# EAGLE design SparkFun_Pulse_Oximeter_Heart-Rate_Sensor (EAGLE 9.6.2)
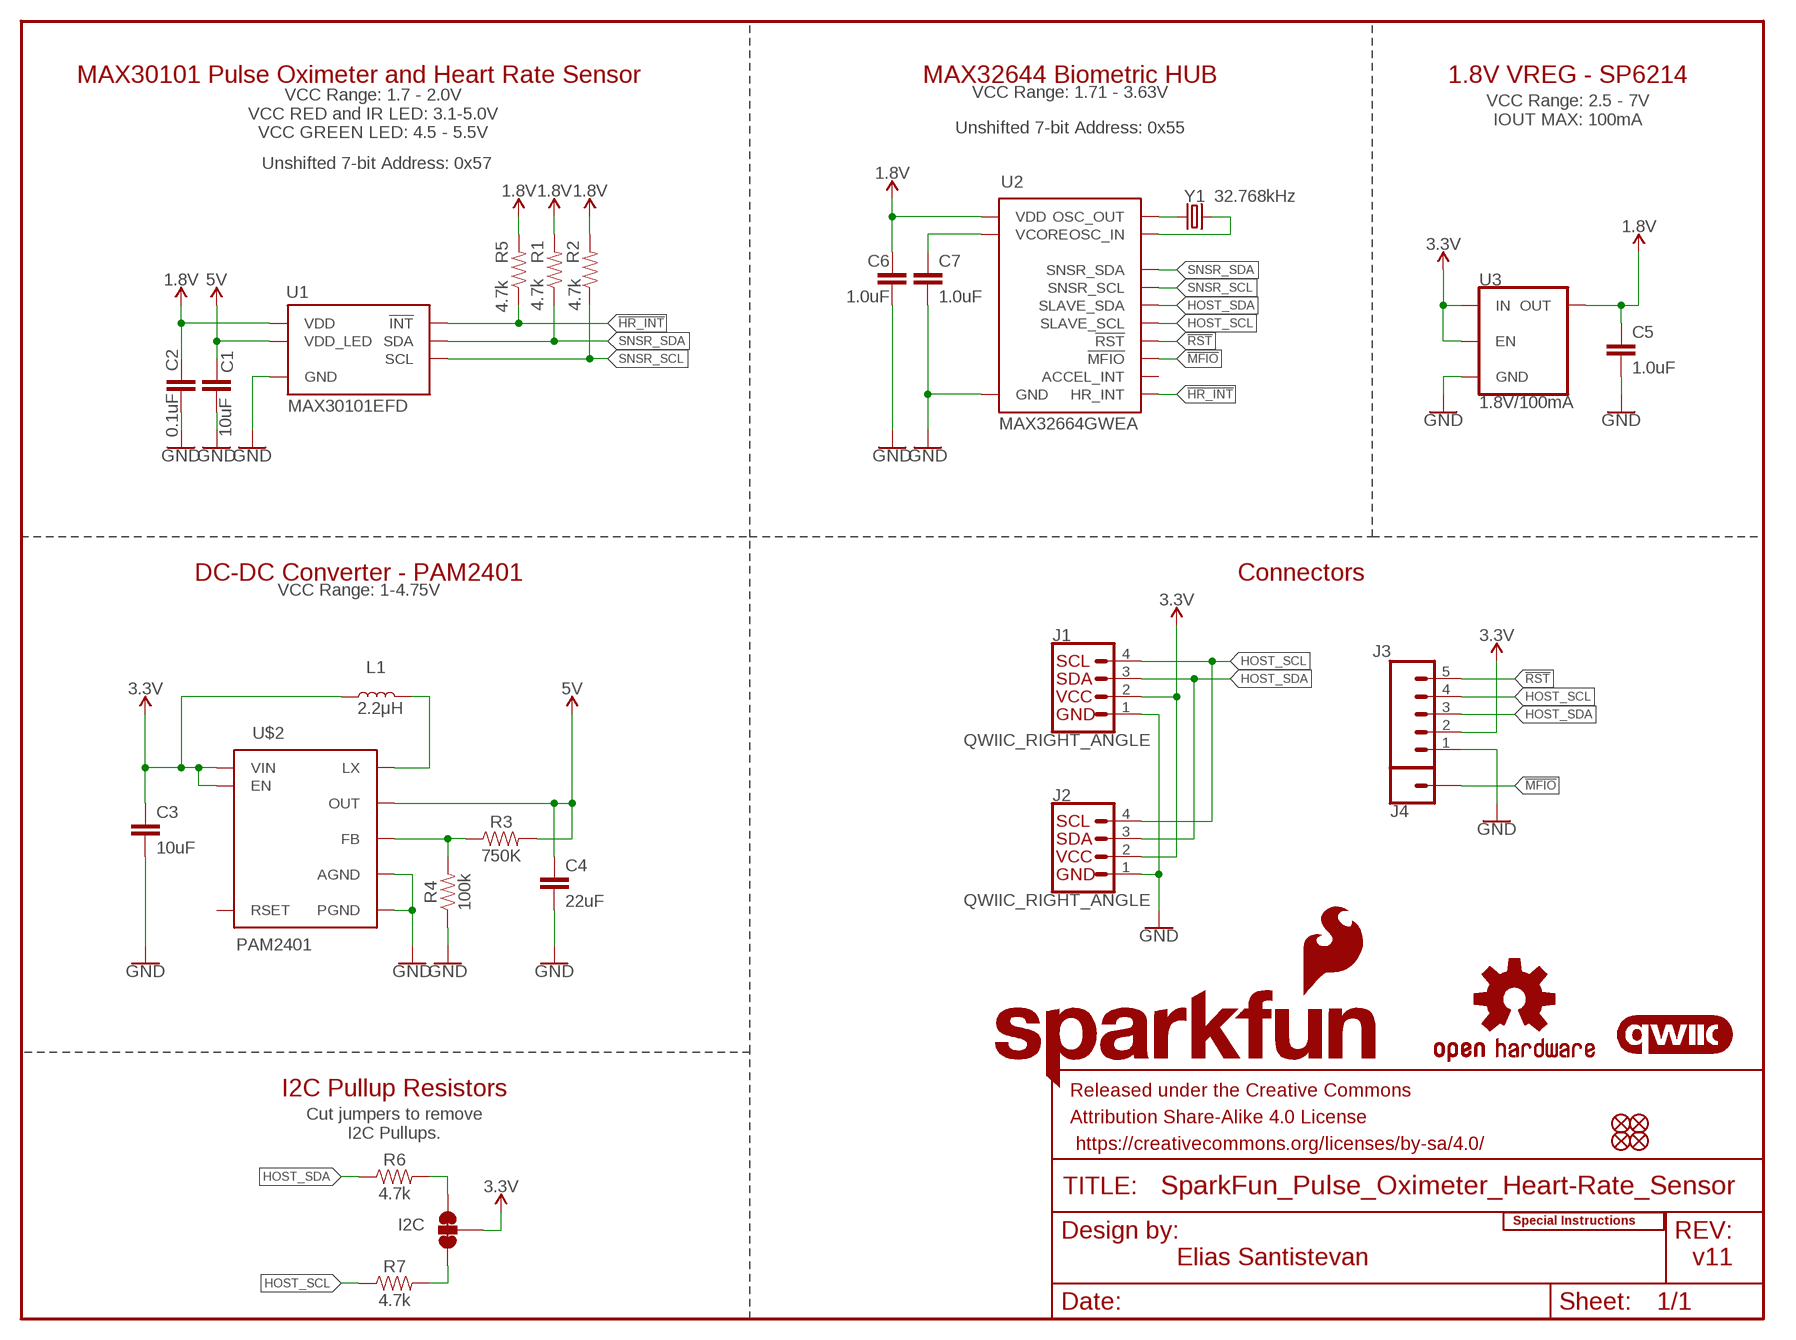
[diagram p0: schematic, sheet 1]

## Parts
C1  10uF  10UF-0603-6.3V-20%  [0603]
C2  0.1uF  0.1UF-0402T-16V-10%  [0402-TIGHT]
C3  10uF  10UF-0603-6.3V-20%  [0603]
C4  22uF  22UF-0805-6.3V-20%  [0805]
C5  1.0uF  1.0UF-0603-16V-10%  [0603]
C6  1.0uF  1.0UF-0402T-16V-10%  [0402-TIGHT]
C7  1.0uF  1.0UF-0402T-16V-10%  [0402-TIGHT]
FD1  FIDUCIALUFIDUCIAL  [FIDUCIAL-MICRO]
FD2  FIDUCIALUFIDUCIAL  [FIDUCIAL-MICRO]
FD3  FIDUCIALUFIDUCIAL  [FIDUCIAL-MICRO]
FD4  FIDUCIALUFIDUCIAL  [FIDUCIAL-MICRO]
FRAME1  FRAME-LETTER  [CREATIVE_COMMONS]
I2C  JUMPER-SMT_3_2-NC_TRACE_SILK  [SMT-JUMPER_3_2-NC_TRACE_SILK]
J1  QWIIC_RIGHT_ANGLE  QWIIC_CONNECTORJS-1MM  [JST04_1MM_RA]
J2  QWIIC_RIGHT_ANGLE  QWIIC_CONNECTORJS-1MM  [JST04_1MM_RA]
J3  CONN_05NO_SILK  [1X05_NO_SILK]
J4  CONN_01PTH_NO_SILK_YES_STOP  [1X01_NO_SILK]
L1  2.2μH  2.2μH_SHIELDED_INDUCTOR  [0806]
LOGO1  SFE_LOGO_FLAME.1_INCH  [SFE_LOGO_FLAME_.1]
LOGO2  OSHW-LOGOMINI  [OSHW-LOGO-MINI]
LOGO3  SFE_LOGO_NAME.1_INCH  [SFE_LOGO_NAME_.1]
LOGO4  SPECIAL_INSTRUCTIONS-ORDERING  [ORDERING_INSTRUCTIONS]
LOGO5  QWIIC_LOGO_4MM  [QWIIC_4MM]
R1  4.7k  4.7KOHM-0603-1/10W-1%  [0603]
R2  4.7k  4.7KOHM-0603-1/10W-1%  [0603]
R3  750K  750KOHM-0603-1/10W-1%  [0603]
R4  100k  100KOHM-0402T-1/16W-1%  [0402-TIGHT]
R5  4.7k  4.7KOHM-0603-1/10W-1%  [0603]
R6  4.7k  4.7KOHM-0603-1/10W-1%  [0603]
R7  4.7k  4.7KOHM-0603-1/10W-1%  [0603]
U1  MAX30101EFD  [14_PIN_OESIP]
U2  MAX32664GWEA  [16_PIN_WLP]
U3  1.8V/100mA  V_REG_SP6214-1.8V  [SC70]
U$2  PAM2401  [MSOP8]
Y1  32.768kHz  CRYSTAL-32.768KHZSMD-3.2X1.5  [CRYSTAL-SMD-3.2X1.5MM]

## Nets
1.8V: C2.1 C5.1 C6.1 R1.2 R2.2 R5.2 U1.P11(VDD) U2.3(VDD) U3.5(OUT)
3.3V: C3.1 I2C.2 J1.2 J2.2 J3.2 L1.1 U3.1(IN) U3.3(EN) U$2.2(EN) U$2.3(VIN)
5V: C1.1 C4.1 R3.2 U1.P9(VDD_LED) U1.P10(VDD_LED) U$2.7(OUT)
!HR_INT: R5.1 U1.P13(!INT) U2.6(HR_INT)
!MFIO: J4.1 U2.16(!MFIO)
!RST: J3.5 U2.12(!RST)
GND: C1.2 C2.2 C3.2 C4.2 C5.2 C6.2 C7.2 J1.1 J2.1 J3.1 R4.1 U1.P4(GND) U1.P12(GND) U2.13(GND) U3.2(GND) U$2.4(AGND) U$2.8(PGND)
HOST_SCL: J1.4 J2.4 J3.4 R7.1 U2.10(SLAVE_SCL)
HOST_SDA: J1.3 J2.3 J3.3 R6.1 U2.9(SLAVE_SDA)
N$1: C7.1 U2.4(VCORE)
N$2: R3.1 R4.2 U$2.5(FB)
N$3: L1.2 U$2.1(LX)
N$4: I2C.3 R6.2
N$5: I2C.1 R7.2
N$6: U2.1(OSC_OUT) Y1.P$1
N$7: U2.2(OSC_IN) Y1.P$2
SNSR_SCL: R2.1 U1.P2(SCL) U2.5(SNSR_SCL)
SNSR_SDA: R1.1 U1.P3(SDA) U2.14(SNSR_SDA)
Unconnected: U2.15(ACCEL_INT) U$2.6(RSET)

## Notes on the sheet
- MAX30101 Pulse Oximeter and Heart Rate Sensor | MAX32644 Biometric HUB | 1.8V VREG - SP6214
- VCC Range: 1.71 - 3.63V
- VCC Range: 2.5 - 7V
  IOUT MAX: 100mA
- VCC Range: 1.7 - 2.0V
  VCC RED and IR LED: 3.1-5.0V
  VCC GREEN LED: 4.5 - 5.5V
- Unshifted 7-bit Address: 0x55
- Unshifted 7-bit Address: 0x57
- DC-DC Converter - PAM2401 | Connectors
- VCC Range: 1-4.75V
- I2C Pullup Resistors
- Cut jumpers to remove
  I2C Pullups.
- Elias Santistevan | v11

## Library data of the parts
C1 C3 = SparkFun-Capacitors:10UF: 10.0µF ceramic capacitors A capacitor is a passive two-terminal electrical component used to store electrical energy temporarily in an electric field.; PROD_ID: CAP-11015
C2 = SparkFun-Capacitors:0.1UF: 0.1µF ceramic capacitors A capacitor is a passive two-terminal electrical component used to store electrical energy temporarily in an electric field.; PROD_ID: CAP-12416
C4 = SparkFun-Capacitors:22UF: 22µF ceramic capacitors A capacitor is a passive two-terminal electrical component used to store electrical energy temporarily in an electric field.; PROD_ID: CAP-08402
C5 = SparkFun-Capacitors:1.0UF: 1µF ceramic capacitors A capacitor is a passive two-terminal electrical component used to store electrical energy temporarily in an electric field.; PROD_ID: CAP-00868
C6 C7 = SparkFun-Capacitors:1.0UF: 1µF ceramic capacitors A capacitor is a passive two-terminal electrical component used to store electrical energy temporarily in an electric field.; PROD_ID: CAP-12417
FD1-FD4 = SparkFun-Aesthetics:FIDUCIAL: Fiducial Alignment Points Point-of-reference for pick-and-place machines and other optical instruments.
FRAME1 = SparkFun-Aesthetics:FRAME-LETTER: Schematic Frame - Letter Standard 8.5x11 US Letter frame
I2C = SparkFun-Jumpers:JUMPER-SMT_3_2-NC_TRACE: Normally closed trace jumper (2 of 2 connections) This jumper has a trace between all three pads so they are normally closed (NC). Use a razor knife to open the connection(s). For best results follow the IPC guidelines for cutting traces: Cutout at least 0.063 mm (0.005 in). Remove all loose material to clean up the cut area. Seal the cut with an approved epoxy. Reapply solder to reclose the connection(s).
J1 J2 = SparkFun-Connectors:QWIIC_CONNECTOR: SparkFun I2C Standard Qwiic Connector An SMD 1mm pitch JST connector makes it easy and quick (get it? Qwiic?) to connect I2C devices to each other. The Qwiic system <http://www.sparkfun.com/qwiic> enables fast and solderless connection between popular platforms and various sensors and actuators. We carry 200mm <https://www.sparkfun.com/products/14204>, 100mm <https://www.sparkfun.com/products/14205>, 50mm <https://www.sparkfun.com/products/14206>, and breadboard friendly <https://www.sparkfun.com/products/14207> Qwiic cables. We also offer 10 pcs strips <https://www.sparkfun.com/products/14323> the SMD connectors.; PROD_ID: CONN-13694
J3 = SparkFun-Connectors:CONN_05: Multi connection point. Often used as Generic Header-pin footprint for 0.1 inch spaced/style header connections On any of the 0.1 inch spaced packages, you can populate with these: Break Away Headers - Straight <https://www.sparkfun.com/products/116> (PRT-00116) Break Away Male Headers - Right Angle <https://www.sparkfun.com/products/553> (PRT-00553) Female Headers <https://www.sparkfun.com/products/115> (PRT-00115) Break Away Headers - Machine Pin <https://www.sparkfun.com/products/117> (PRT-00117) Break Away Female Headers - Swiss Machine Pin <https://www.sparkfun.com/products/743> (PRT-00743) For SCREWTERMINALS and SPRING TERMINALS visit here: Screw Terimnals on SparkFun.com <https://www.sparkfun.com/search/results?term=Screw+Terminals> (5mm/3.5mm/2.54mm spacing) This device is also useful as a general connection point to wire up your design to another part of your project. Our various solder wires solder well into these plated through hole pads. Hook-Up Wire - Assortment (Stranded, 22 AWG) <https://www.sparkfun.com/products/11375> (PRT-11375) Hook-Up Wire - Assortment (Solid Core, 22 AWG) <https://www.sparkfun.com/products/11367> (PRT-11367) View the entire wire category on our website here <https://www.sparkfun.com/categories/141> Special notes: Molex polarized connector foot print use with SKU : PRT-08231 with associated crimp pins and housings. 1MM SMD Version SKU: PRT-10208
J4 = SparkFun-Connectors:CONN_01: Single connection point. Often used as Generic Header-pin footprint for 0.1 inch spaced/style header connections On any of the 0.1 inch spaced packages, you can populate with these: Break Away Headers - Straight <https://www.sparkfun.com/products/116> (PRT-00116) Break Away Male Headers - Right Angle <https://www.sparkfun.com/products/553> (PRT-00553) Female Headers <https://www.sparkfun.com/products/115> (PRT-00115) Break Away Headers - Machine Pin <https://www.sparkfun.com/products/117> (PRT-00117) Break Away Female Headers - Swiss Machine Pin <https://www.sparkfun.com/products/743> (PRT-00743) This device is also useful as a general connection point to wire up your design to another part of your project. Our various solder wires solder well into these plated through hole pads. Hook-Up Wire - Assortment (Stranded, 22 AWG) <https://www.sparkfun.com/products/11375> (PRT-11375) Hook-Up Wire - Assortment (Solid Core, 22 AWG) <https://www.sparkfun.com/products/11367> (PRT-11367) View the entire wire category on our website here <https://www.sparkfun.com/categories/141> Special notes: SMTSO-256-ET is a "flush mount" nut for a 4-40 screw. We mostly use this on specialty testbeds; it is a nice way to connect hardware to your PCB at an adjustable hieght. Also note, the SNAP packages are for using a snappable style connector. We sell a baggie of snaps and they are also used on two LilyPad designs: Snap Assortment - 30 pack (male and female) <https://www.sparkfun.com/products/11347> (DEV-11347) LilyPad Arduino SimpleSnap <https://www.sparkfun.com/products/10941> (DEV-10941) LilyPad SimpleSnap Protoboard <https://www.sparkfun.com/products/10940> (DEV-10940)
L1 = SparkFun-Coils:2.2μH_SHIELDED_INDUCTOR: Murata 2.2uH Inductor 2.2uH 1.2A 110mOhm 0806 Package Shielded Bourns 2.2uH Inductor 2.2uH 5.5A 205mOhm 5x5mm Package Shielded; PROD_ID: NDUC-14257
LOGO1 = SparkFun-Aesthetics:SFE_LOGO_FLAME: SparkFun Flame Logo This is the SparkFun flame logo. The logo on the schematic will always be the same size; the package variant is the height of the flame. Default layer for the logo on the board is tSilk.
LOGO2 = SparkFun-Aesthetics:OSHW-LOGO: Open-Source Hardware (OSHW) Logo This logo indicates the piece of hardware it is found on incorporates a OSHW license and/or adheres to the definition of open source hardware found here: http://freedomdefined.org/OSHW
LOGO3 = SparkFun-Aesthetics:SFE_LOGO_NAME: SparkFun Font Logo This is the SparkFun name logo. The logo on the schematic will always be the same size; the package variant is the height of the flame part of the logo (or the height the flame would be, if it were drawn). Default layer for the logo on the board is tSilk.
LOGO4 = SparkFun-Aesthetics:SPECIAL_INSTRUCTIONS: Special Ordering/Production Instructions Alert Symbol for special PCB ordering instructions or unique production process warnings. Ordering Instructions Production Instructions Types of information that should be added to box: Copper weight Soldermask color Silk color PCB thickness Number of layers PCB Standard: 1.6mm FR4 1 oz copper immersion silver plating red soldermask white silkscreen Types of information that should be added to box: Special wash requirements Depaneling instructions Humidification Glue curing Default text settings: 0.07 inch 9% ratio 50% line distance
LOGO5 = SparkFun-Aesthetics:QWIIC_LOGO: Qwiic Logos for placement on schematic and PCB. The 5.5mm silk logo is best for placing next to Qwiic connector.
R1 R2 R5-R7 = SparkFun-Resistors:4.7KOHM: 4.7kΩ resistor A resistor is a passive two-terminal electrical component that implements electrical resistance as a circuit element. Resistors act to reduce current flow, and, at the same time, act to lower voltage levels within circuits. - Wikipedia; PROD_ID: RES-07857
R3 = SparkFun-Resistors:750KOHM: 750Ω resistor A resistor is a passive two-terminal electrical component that implements electrical resistance as a circuit element. Resistors act to reduce current flow, and, at the same time, act to lower voltage levels within circuits. - Wikipedia; PROD_ID: RES-13768
R4 = SparkFun-Resistors:100KOHM: 100kΩ resistor A resistor is a passive two-terminal electrical component that implements electrical resistance as a circuit element. Resistors act to reduce current flow, and, at the same time, act to lower voltage levels within circuits. - Wikipedia; PROD_ID: RES-13495
U1 = SparkFun-IC-Special-Function:MAX30101EFD: MAX30101 High-Sensitivity Pulse Oximeter and Heart-Rate Sensor The MAX30101 is an integrated pulse oximetry and heart-rate monitor module. It includes internal LEDs, photodetectors, optical elements, and low-noise electronics with ambient light rejection. The MAX30101 provides a complete system solution to ease the design-in process for mobile and wearable devices. The MAX30101 operates on a single 1.8V power supply and a separate 5.0V power supply for the internal LEDs. Communication is through a standard I2C-compatible interface. The module can be shut down through software with zero standby current, allowing the power rails to remain powered at all times; PROD_ID: IC-14270
U2 = SparkFun-IC-Special-Function:MAX32664GWEA: Maxim MAX32664 Biometric Sensor Hub he MAX32664 is a sensor hub family with embedded firmware and algorithms for wearables. It seamlessly enables customer-desired sensor functionality, including communication with Maxim’s optical sensor solutions and delivering raw or calculated data to the outside world. This is achieved while keeping overall system power consumption in check. The MAX32664 Version A supports the MAX30101/ MAX30102 high-sensitivity pulse oximeter and heart rate sensor for wearable health for finger-based applications.; PROD_ID: IC-14271
U3 = SparkFun-IC-Power:V_REG_SP6214: Voltage Regulator - SP6214 SP6214 Series SC-70-5 Micropower SC-70 100 mA CMOS LDO Regulator Datasheet <https://www.exar.com/content/document.ashx?id=654> SparkFun Products: MP3 Trigger <https://www.sparkfun.com/products/13720> SparkFun Particle Sensor Breakout <https://www.sparkfun.com/products/14045>; PROD_ID: VREG-08428
U$2 = SparkFun-IC-Power:PAM2401: PAM2401 - Boost PMIC Specifications: Up to 1A output current 0.9V to 4.75V Input Range 2.5V to 5.0V Adjustable Output Voltage Datasheet <https://www.diodes.com/assets/Datasheets/PAM2401.pdf> (Diodes inc.); PROD_ID: IC-13769
Y1 = SparkFun-Clocks:CRYSTAL-32.768KHZ: 32.768kHz Crystal Frequency: 32.768kHz Frequency Stability: ±20ppm Load Capacitance: 12.5pF (PTH-2X6 & SMD-3.2X1.5), 6pF (SMD-2X6) SparkFun Products: SparkFun BigTime Watch Kit <https://www.sparkfun.com/products/11734> SparkFun nRF52832 Breakout <https://www.sparkfun.com/products/13990> SparkFun Real Time Clock Module <https://www.sparkfun.com/products/12708>; PROD_ID: XTAL-13062

## Board
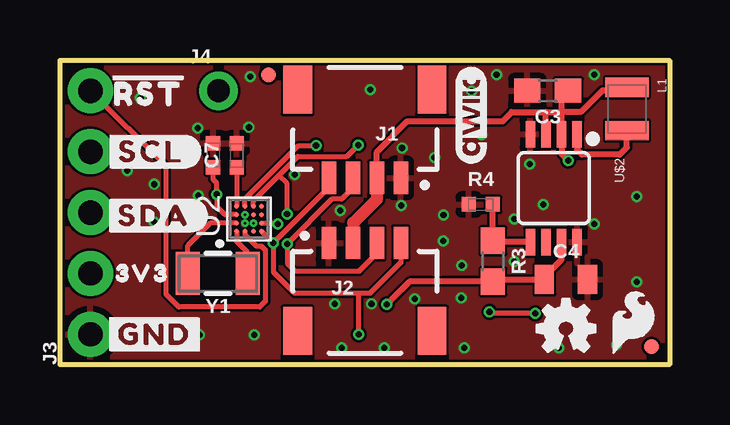
[diagram p1: board, top side]
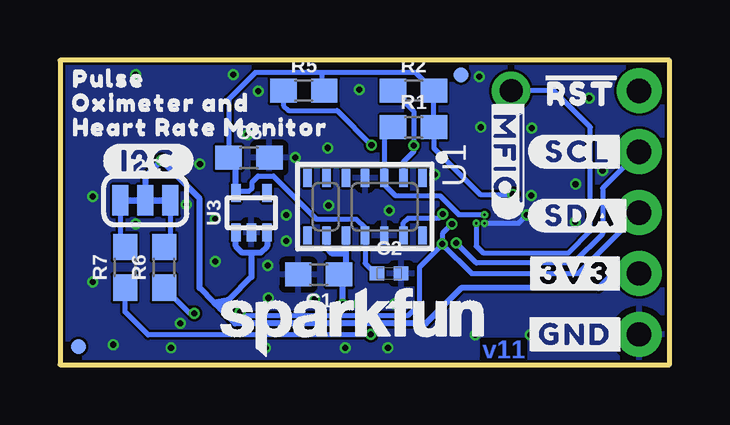
[diagram p2: board, bottom side, seen from below]

Size 25.4 x 12.7 mm. Coordinates in mm from the lower left corner, seen from the top.
Outline: 0,0 0,12.7 25.4,12.7 25.4,0 0,0
Copper layers (1*16): Top 0.035mm / dielectric 1.5mm / Bottom 0.035mm
Design rules "SparkFun-2-layer-FAB-LIMIT *": minimum track width 4mil, minimum drill 4mil, track to track 4mil, track to pad 4mil, pad to pad 4mil, via to via 4mil, smd to smd 4mil, copper to edge 4mil, drill to drill 4mil, minimum pad ring 5mil, minimum via ring 4mil, stop-mask expansion 4mil, vias tented up to drill 25mil, thermal gap 10mil

### Footprints (pad centres in the part's own frame; a part is rotated, then mirrored left to right if it is on the bottom)
0603 = smd 1.1 x 1: 1 -0.85,0; 2 0.85,0
0402-TIGHT = smd 0.6 x 0.6: 1 -0.5,0; 2 0.5,0
0805 = smd 0.8 x 1.2: 1 -0.9,0; 2 0.9,0
FIDUCIAL-MICRO = smd 0.635 x 0.635: 1 0,0
SMT-JUMPER_3_2-NC_TRACE_SILK = smd 0.66 x 1.27: 1 -1.041,0; 2 0,0; 3 1.041,0
JST04_1MM_RA = smd 0.6 x 1.35: 1 -1.5,0; 2 -0.5,0; 3 0.5,0; 4 1.5,0 | smd 1.2 x 2: NC1 2.8,-3.675; NC2 -2.8,-3.675
1X05_NO_SILK = drill 1.016 pad 1.88: 1 0,0; 2 2.54,0; 3 5.08,0; 4 7.62,0; 5 10.16,0
1X01_NO_SILK = drill 0.95 pad 1.6: 1 0,0
0806 = smd 0.8 x 1.8: 1 -0.9,0; 2 0.9,0
14_PIN_OESIP = smd 0.75 x 0.35: P1 -1.193,2.409; P2 -1.193,1.609; P3 -1.193,0.809; P4 -1.193,0.009; P5 -1.193,-0.791; P6 -1.193,-1.591; P7 -1.193,-2.391; P8 1.207,-2.391; P9 1.207,-1.591; P10 1.207,-0.791; P11 1.207,0.009; P12 1.207,0.809; P13 1.207,1.609; P14 1.207,2.409
16_PIN_WLP = smd 0.2 x 0.2: 1 -0.532,0.518; 2 -0.182,0.518; 3 0.168,0.518; 4 0.518,0.518; 5 0.518,0.168; 6 0.518,-0.182; 7 0.518,-0.532; 8 0.168,-0.532; 9 -0.182,-0.532; 10 -0.532,-0.532; 11 -0.532,-0.182; 12 -0.532,0.168; 13 -0.182,0.168; 14 0.168,0.168; 15 0.168,-0.182; 16 -0.182,-0.182
SC70 = smd 0.4 x 0.75: 1 -0.65,-0.825; 2 0,-0.825; 3 0.65,-0.825; 4 0.65,0.825; 5 -0.65,0.825
MSOP8 = smd 0.4 x 1.1: 1 -0.975,-2.25; 2 -0.325,-2.25; 3 0.325,-2.25; 4 0.975,-2.25; 5 0.975,2.25; 6 0.325,2.25; 7 -0.325,2.25; 8 -0.975,2.25
CRYSTAL-SMD-3.2X1.5MM = smd 1 x 1.8: P$1 -1.25,0; P$2 1.25,0

### Placement (x,y rotation side)
C1  14.62,3.76 180 bottom
C2  11.68,3.81 0 bottom
C3  20.32,11.43 180 top
C4  21.08,3.56 0 top
C5  17.53,8.64 0 bottom
C6  6.38,8.74 90 top
C7  7.37,8.74 90 top
FD1  8.69,12.08 0 bottom
FD2  8.69,12.08 0 top
FD3  24.64,0.76 0 bottom
FD4  24.64,0.76 0 top
FRAME1  -4.32,-10.16 0 top  (outside the outline)
I2C  21.84,6.86 0 bottom
J1  12.7,7.8 180 top
J2  12.7,5.08 0 top
J3  1.27,1.27 90 top
J4  6.6,11.43 0 top
L1  23.62,10.67 270 top
LOGO1  23.88,1.78 0 top
LOGO2  21.08,1.52 0 top
LOGO3  13.21,1.78 0 bottom
LOGO4  38.61,50.8 0 top  (outside the outline)
LOGO5  17.14,10.41 90 top
R1  10.67,9.91 0 bottom
R2  10.67,11.43 0 bottom
R3  18.03,4.32 270 top
R4  17.53,6.69 0 top
R5  15.24,11.43 0 bottom
R6  21.06,4.06 90 bottom
R7  22.68,4.06 90 bottom
U1  12.7,6.6 270 bottom
U2  7.87,6.1 90 top
U3  17.42,6.35 0 bottom
U$1  [#I2C#1348]  21.72,8.51 0 bottom
U$2  20.57,7.37 180 top
U$3  [#GND#0]  3.94,1.27 0 top
U$4  [#SCL#7]  3.81,8.89 0 top
U$5  [#GND#0]  3.94,1.27 0 bottom
U$6  [#RST#32]  3.68,11.43 0 top
U$7  [3V338]  3.43,3.81 0 top
U$8  [#SDA#10]  3.94,6.22 0 top
U$9  [#3V3#1]  3.94,3.81 0 bottom
U$10  [#SDA#9]  3.68,6.22 0 bottom
U$11  [#SCL#9]  3.81,8.89 0 bottom
U$12  [#RST#32]  3.68,11.43 0 bottom
U$13  [##MFIO##12]  6.73,8.64 270 bottom
U$17  [PULSE35]  23.37,11.94 0 bottom
U$20  [OXIMETER_AND36]  21.21,10.92 0 bottom
U$21  [HEART_RATE_MONITOR37]  19.56,9.91 0 bottom
Y1  6.58,3.81 180 top

### Tracks (layer width: path | path; a pad name or v marks a point on that pad's centre or on a via)
1.8V  (via drill 0.25)
  Top 0.203: U2.3 6.87,6.26 6.53,6.6 v6.53,7.11 6.53,7.59 6.38,7.74 C6.1
  Bottom 0.203: 14.48,12.19 10.58,12.19 R2.2 R1.2 9.82,9.04 7.89,7.11 v6.53,7.11 | 14.48,12.19 17.27,12.19 18.38,11.09 C5.1 | R5.2 14.48,11.52 14.48,12.19 | U3.5 18.01,7.24 17.53,7.24 17.4,7.37 17.4,7.62 17.14,7.87 16.51,7.87 14.7,6.07 13.05,6.07 12.69,5.71 U1.P11 12.69,4.24 12.26,3.81 C2.1
  Bottom 0.254: U3.5 18.07,8.33 C5.1
3.3V  (via drill 0.25)
  Top 0.254: 20.9,10.54 U$2.2 20.9,8.8 v21.18,8.52 | 20.9,10.54 20.9,11.16 C3.1 | L1.1 23.5,11.44 22.6,11.44 21.7,10.54 20.9,10.54 | J1.2 13.2,8.88 14.48,10.16 18.44,10.16 18.82,10.54 20.24,10.54 | 20.24,10.54 20.9,10.54 | U$2.3 20.25,10.54 20.24,10.54
  Top 0.508: J1.2 13.2,6.9 12.22,5.92 12.22,5.1 J2.2
  Bottom 0.254: J3.2 2.35,3.81 2.95,3.2 8.68,3.2 10.16,1.73 18.11,1.73 18.54,2.16 | I2C.2 21.84,7.85 v21.18,8.52 21.17,8.52 19.58,6.93 19.58,3.2 18.99,2.6 | 18.54,2.16 18.73,2.35 | 18.73,2.35 18.99,2.6 | U3.3 16.77,4.94 17.05,4.67 17.42,4.67 | 17.42,4.67 17.8,4.67 18.07,4.94 U3.1 | 17.42,4.67 17.42,3.66 18.35,2.73 | 18.73,2.35 18.35,2.73 | 18.99,2.6 18.35,2.73 | 18.35,2.73 18.54,2.16
5V  (via drill 0.25)
  Top 0.254: 20.07,3.56 18.12,3.56 R3.2 14.57,3.47 v13.61,2.52 | 20.07,3.56 C4.1 | 20.07,3.56 20.9,4.39 U$2.7
  Bottom 0.254: v13.61,2.52 13.61,3.6 | 13.61,3.6 13.61,3.8 13.49,3.92 13.49,4.65 | 13.61,3.6 C1.1 | U1.P10 13.49,4.65 | U1.P9 14.29,4.87 14.07,4.65 13.49,4.65
!HR_INT  (via drill 0.25)
  Top 0.203: v12.42,9.17 11.94,8.69 9.91,8.69 9.12,7.9 | 9.12,7.9 8.06,6.84 U2.6 | v9.46,6.29 9.46,7.56 9.12,7.9
  Bottom 0.203: U1.P13 11.09,5.93 10.9,6.12 9.63,6.12 v9.46,6.29 | R5.1 16.09,10.82 15.88,10.6 13.86,10.6 v12.42,9.17
!MFIO  (via drill 0.1)
  Top 0.203: U2.16
  Bottom 0.203: U2.16 8.06,4.96 7.78,4.67 4.2,4.67 3.3,5.57 3.3,9.91 4.83,11.43 J4.1
  other vias: 8.06,5.91
!RST
  Top 0.203: J3.5 4.42,8.28 4.42,2.95 4.95,2.41 8.33,2.41 8.56,2.64 8.56,4.78 8.39,4.95 8.18,4.95 7.71,5.43 U2.12
GND  (via drill 0.1, 0.25)
  Top 0.203: U2.13 | U2.13
  Bottom 0.203: U2.13 6.28,5.91 v5.94,6.25
  other vias: 7.87,9.91 5.74,9.88 7.71,5.91 11.67,6.43 15.98,6.26 15.97,5.16 19.57,8.37 20.39,1.73 3.93,5.95 3.92,7.53 5.81,1.25 8.1,1.25 14.78,2.74 16.71,2.79 13.51,0.71 11.73,0.71 16.74,4.14 14.25,9.05 15.61,8.64 17.15,11.41 18.19,12.1 24.03,7.02 24.03,3.46 17.58,9.6 16.84,0.71 20.77,0.71 3.35,11.13 14.21,6.64 11.46,2.54 12.98,2.54 18.93,6.09 18.93,4.31 22.25,12.1 5.77,7.06 23.19,0.84 7.92,12.01 20.14,6.68 22.25,5.88 9.78,7.93 2.79,8.1 12.93,11.48
  pour Top: 0,12.7 0,0 25.4,0 25.4,12.7
  pour Bottom: 0,12.7 0,0 25.4,0 25.4,12.7
HOST_SCL  (via drill 0.25)
  Top 0.203: J2.4 14.2,4.27 12.93,3 12.45,3 | J1.4 11.2,7.39 v8.89,5.08 | 12.45,3 9.76,3 8.89,3.87 v8.89,5.08 | v12.45,1.27 12.45,3 | U2.10 v8.89,5.08
  Bottom 0.203: J3.4 2.79,7.37 2.79,5.46 4.01,4.24 8.05,4.24 v8.89,5.08 | v12.45,1.27 12.47,1.25 21.73,1.25 22.68,2.2 R7.1
HOST_SDA  (via drill 0.25)
  Top 0.203: J2.3 13.2,4.64 12.47,3.91 9.78,3.91 9.47,4.22 v9.47,5.03 9.47,5.05 11.33,6.91 11.73,6.91 12.2,7.37 J1.3 | v19.8,2.15 17.95,2.15 v17.89,2.21 | v9.07,5.87 9.03,5.91 U2.9
  Bottom 0.203: v9.07,5.87 9.47,5.47 v9.47,5.03 | v9.47,5.03 8.25,3.81 3.81,3.81 J3.3 | R6.1 19.99,2.15 v19.8,2.15 | v17.89,2.21 17.75,2.07 10.89,2.07 10.41,2.54 10.41,4.08 v9.47,5.03
N$1
  Top 0.203: U2.4 7.36,8.23 C7.1
N$2
  Top 0.254: U$2.5 18.09,5.12 R3.1 R4.2
N$3
  Top 0.254: U$2.1 21.55,8.97 21.76,8.77 23.32,8.77 23.62,9.06 L1.2
N$4
  Bottom 0.203: I2C.3 20.8,5.17 R6.2
N$5
  Bottom 0.203: R7.2 22.85,5.09 22.86,5.09 22.89,5.12 I2C.1
N$6
  Top 0.203: Y1.P$1 7.83,3.91 7.8,3.94 7.8,4.7 7.36,5.14 U2.1 | U2.1
N$7
  Top 0.203: Y1.P$2 5.33,4.97 6.27,5.91 U2.2
SNSR_SCL  (via drill 0.25)
  Top 0.203: v10.67,9.14 9.93,9.14 7.71,6.92 U2.5
  Bottom 0.203: R2.1 10.67,10.58 v10.67,9.14 10.67,8.89 11.09,8.47 U1.P2
SNSR_SDA  (via drill 0.1)
  Bottom 0.203: R1.1 11.89,9.53 U1.P3 11.89,7.51 11.43,7.05 9.58,7.05 8.79,6.26 U2.14
  other vias: 7.71,6.26

### Text on the board
Bottom: v11
Measures: Measurements in Inches
tDocu: Via on Pad for small BGA | Finish: ENIG | 2-Layer Board | Soldermask: Red / Silk: White | Elias Santistevan